# Altium schematic sheet Sheet2.SchDoc
size A1
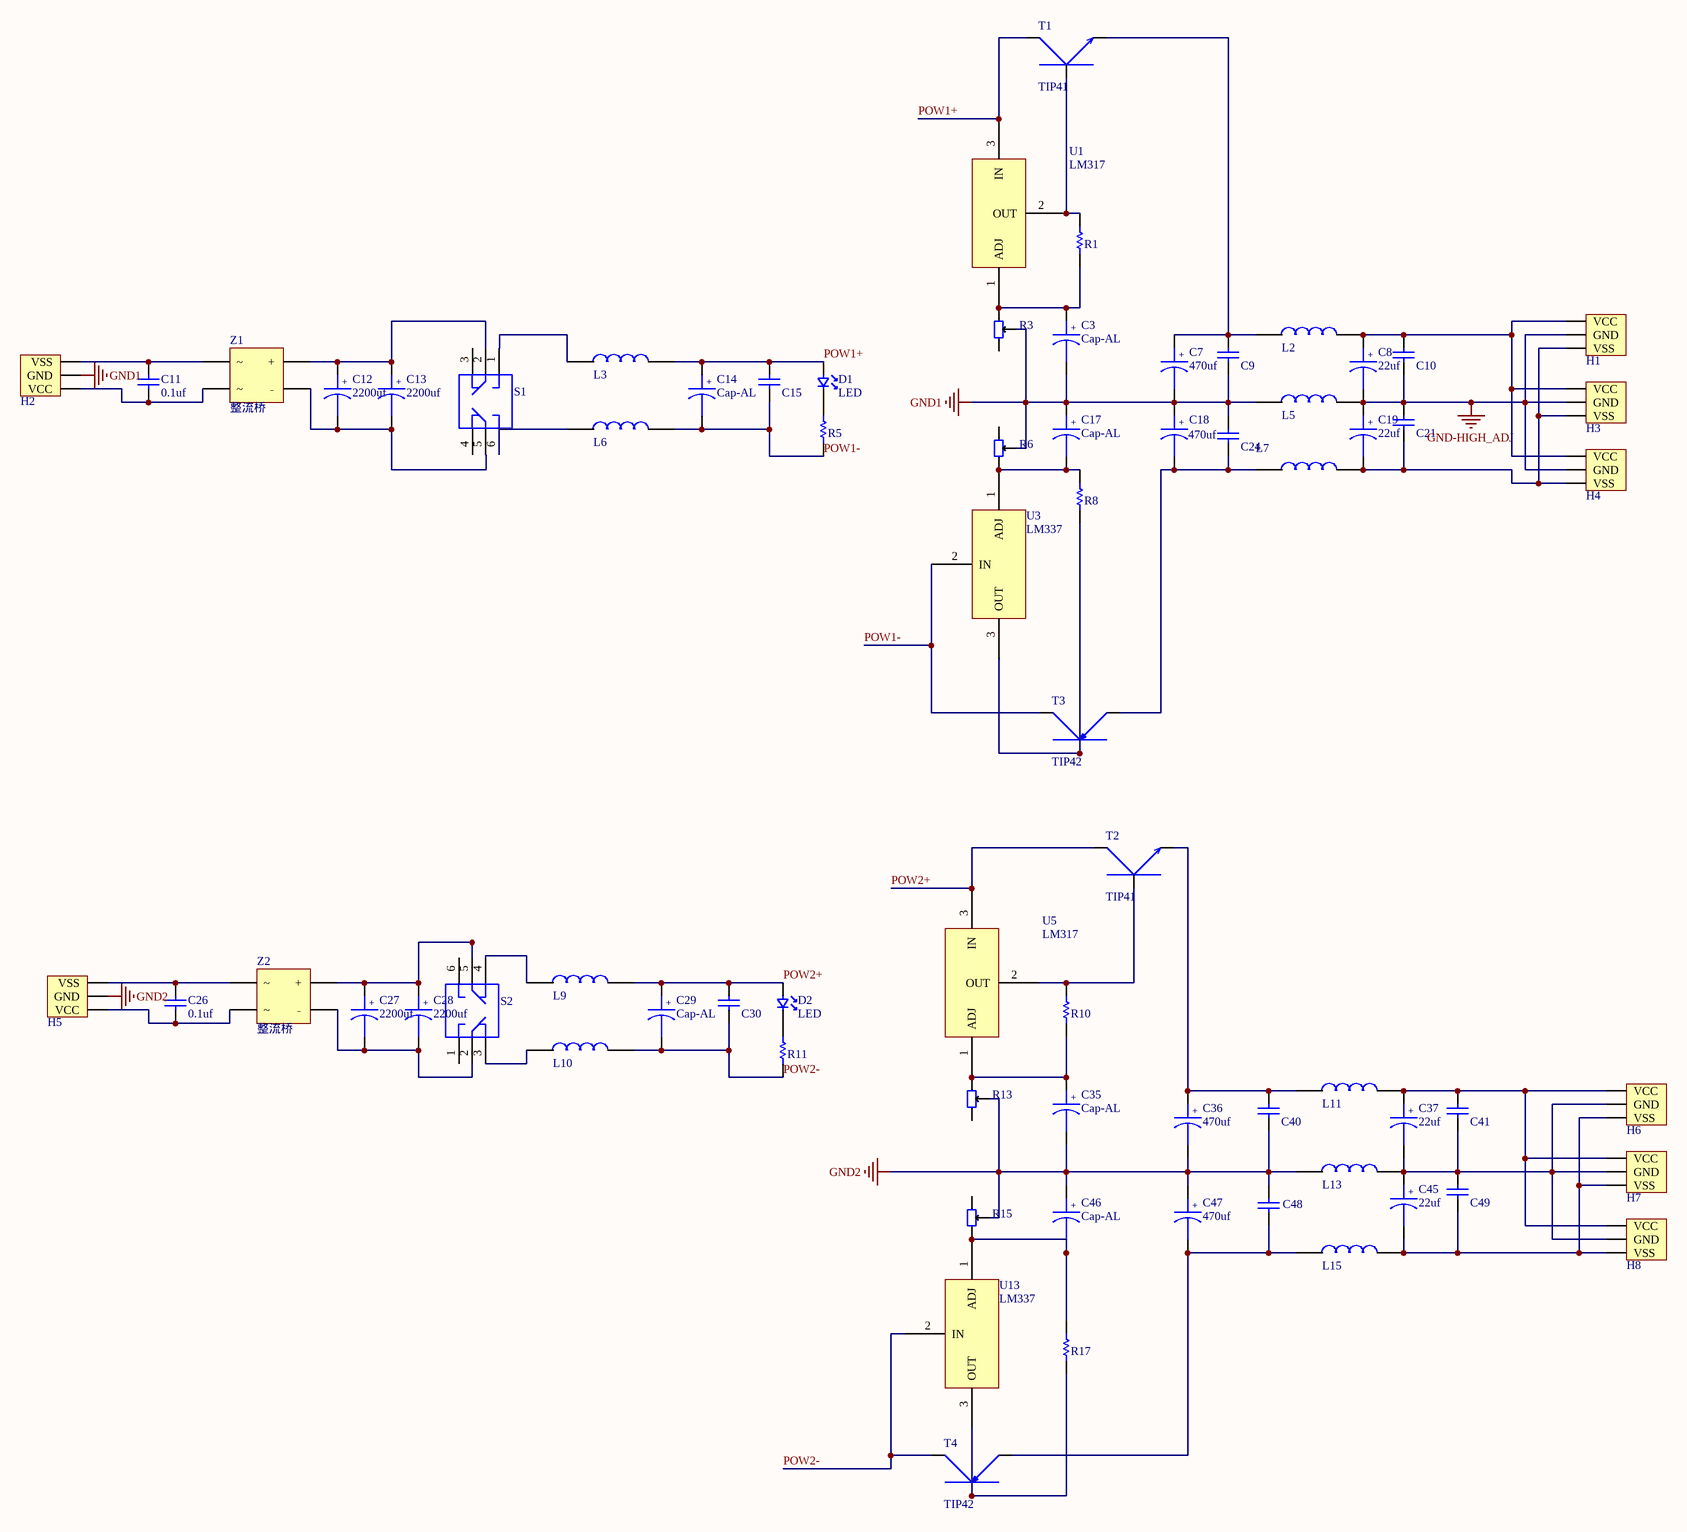
[diagram p0: Sheet2.SchDoc]

## Parts
C3  Cap-AL  [CD-2.2mm]
C7  470uf  [CD-5mm]
C8  22uf  [CD-3mm]
C9  Cap-SEMI  [独石电容]  (value not drawn)
C10  Cap-SEMI  [独石电容]  (value not drawn)
C11  值: 0.1uf  [安规电容]  (hidden comment: Cap1)
C12  2200uf  [CD-7.6mm]
C13  2200uf  [CD-7.6mm]
C14  Cap-AL  [CD-3mm]
C15  0.1uf  [独石电容]  (value not drawn)
C17  Cap-AL  [CD-2.2mm]
C18  470uf  [CD-5mm]
C19  22uf  [CD-3mm]
C21  Cap-SEMI  [独石电容]  (value not drawn)
C24  Cap-SEMI  [独石电容]  (value not drawn)
C26  值: 0.1uf  [安规电容]  (hidden comment: Cap1)
C27  2200uf  [CD-7.6mm]
C28  2200uf  [CD-7.6mm]
C29  Cap-AL  [CD-3mm]
C30  0.1uf  [独石电容]  (value not drawn)
C35  Cap-AL  [CD-2.2mm]
C36  470uf  [CD-5mm]
C37  22uf  [CD-3mm]
C40  Cap-SEMI  [独石电容]  (value not drawn)
C41  Cap-SEMI  [独石电容]  (value not drawn)
C45  22uf  [CD-3mm]
C46  Cap-AL  [CD-2.2mm]
C47  470uf  [CD-5mm]
C48  Cap-SEMI  [独石电容]  (value not drawn)
C49  Cap-SEMI  [独石电容]  (value not drawn)
D1  LED  [0805_s]
D2  LED  [0805_s]
H1  KF128-5.08-3P  [KF128-5.08-3P]  (value not drawn)
H2  KF128-5.08-3P  [KF128-5.08-3P]  (value not drawn)
H3  KF128-5.08-3P  [KF128-5.08-3P]  (value not drawn)
H4  KF128-5.08-3P  [KF128-5.08-3P]  (value not drawn)
H5  KF128-5.08-3P  [KF128-5.08-3P]  (value not drawn)
H6  KF128-5.08-3P  [KF128-5.08-3P]  (value not drawn)
H7  KF128-5.08-3P  [KF128-5.08-3P]  (value not drawn)
H8  KF128-5.08-3P  [KF128-5.08-3P]  (value not drawn)
L2  SMD  [功率电感-12x12 - duplicate]  (value not drawn)
L3  SMD  [功率电感-12x12 - duplicate]  (value not drawn)
L5  SMD  [功率电感-12x12 - duplicate]  (value not drawn)
L6  SMD  [功率电感-12x12 - duplicate]  (value not drawn)
L7  SMD  [功率电感-12x12 - duplicate]  (value not drawn)
L9  SMD  [功率电感-12x12 - duplicate]  (value not drawn)
L10  SMD  [功率电感-12x12 - duplicate]  (value not drawn)
L11  SMD  [功率电感-12x12 - duplicate]  (value not drawn)
L13  SMD  [功率电感-12x12 - duplicate]  (value not drawn)
L15  SMD  [功率电感-12x12 - duplicate]  (value not drawn)
R1  RES  [0805]  (value not drawn)
R3  可调电位器1  [电位器]  (value not drawn)
R5  RES  [0805]  (value not drawn)
R6  可调电位器1  [电位器]  (value not drawn)
R8  RES  [0805]  (value not drawn)
R10  RES  [0805]  (value not drawn)
R11  RES  [0805]  (value not drawn)
R13  可调电位器1  [电位器]  (value not drawn)
R15  可调电位器1  [电位器]  (value not drawn)
R17  RES  [0805]  (value not drawn)
S1  双掷开关  [SWITCH]  (value not drawn)
S2  双掷开关  [SWITCH]  (value not drawn)
T1  TIP41  [TO-220]
T2  TIP41  [TO-220]
T3  TIP42  [TO-220]
T4  TIP42  [TO-220]
U1  LM317  [TO-220]
U3  LM337  [TO-220]
U5  LM317  [TO-220]
U13  LM337  [TO-220]
Z1  整流桥  [整流桥]
Z2  整流桥  [整流桥]

## Nets
GND1: C3.2 C7.2 C9.1 C17.1 C18.1 C24.2 H2.2(GND) L5.1 R3.2 R6.2
GND2: C35.2 C36.2 C40.1 C46.1 C47.1 C48.2 H5.2(GND) L13.1 R13.2 R15.2
GND-HIGH_ADJ: C8.2 C10.1 C19.1 C21.2 H1.2(GND) H3.2(GND) H4.2(GND) L5.2
POW1+: C14.1 C15.2 D1.2 L3.2 T1.2 U1.3(IN)
POW1-: C14.2 C15.1 L6.2 R5.1 T3.2 U3.2(IN)
POW2+: C29.1 C30.2 D2.2 L9.2 T2.2 U5.3(IN)
POW2-: C29.2 C30.1 L10.2 R11.1 T4.2 U13.2(IN)
NetC3_1: C3.1 R1.1 R3.3 U1.1(ADJ)
NetC7_1: C7.1 C9.2 L2.1 T1.3
NetC8_1: C8.1 C10.2 H1.1(VCC) H3.1(VCC) H4.1(VCC) L2.2
NetC11_1: C11.1 H2.1(VCC) Z1.3
NetC11_2: C11.2 H2.3(VSS) Z1.2
NetC12_1: C12.1 C13.1 S1.2 Z1.1(+)
NetC12_2: C12.2 C13.2 S1.5 Z1.4(﹣)
NetC17_2: C17.2 R6.1 R8.2 U3.1(ADJ)
NetC18_2: C18.2 C24.1 L7.1 T3.3
NetC19_2: C19.2 C21.1 H1.3(VSS) H3.3(VSS) H4.3(VSS) L7.2
NetC26_1: C26.1 H5.1(VCC) Z2.3
NetC26_2: C26.2 H5.3(VSS) Z2.2
NetC27_1: C27.1 C28.1 S2.5 Z2.1(+)
NetC27_2: C27.2 C28.2 S2.2 Z2.4(﹣)
NetC35_1: C35.1 R10.1 R13.3 U5.1(ADJ)
NetC36_1: C36.1 C40.2 L11.1 T2.3
NetC37_1: C37.1 C41.2 H6.1(VCC) H7.1(VCC) H8.1(VCC) L11.2
NetC37_2: C37.2 C41.1 C45.1 C49.2 H6.2(GND) H7.2(GND) H8.2(GND) L13.2
NetC45_2: C45.2 C49.1 H6.3(VSS) H7.3(VSS) H8.3(VSS) L15.2
NetC46_2: C46.2 R15.1 R17.2 U13.1(ADJ)
NetC47_2: C47.2 C48.1 L15.1 T4.3
NetD1_1: D1.1 R5.2
NetD2_1: D2.1 R11.2
NetL3_1: L3.1 S1.1
NetL6_1: L6.1 S1.6
NetL9_1: L9.1 S2.4
NetL10_1: L10.1 S2.3
NetR1_2: R1.2 T1.1 U1.2(OUT)
NetR8_1: R8.1 T3.1 U3.3(OUT)
NetR10_2: R10.2 T2.1 U5.2(OUT)
NetR17_1: R17.1 T4.1 U13.3(OUT)

Not connected (* = marked no-connect by the designer): R3 1; R6 3; R13 1; R15 3; S1 3 4; S2 1 6

## Notes on the sheet
- (in symbol Cap) +
- (in symbol Cap-AL) +

## Library data of the parts
C7 C8 C18 C19 C36 C37 C45 C47 = Cap-AL
C12 C13 C27 C28 = Cap
C15 C30 = Cap-SEMI
L2 L3 L5-L7 L9-L11 L13 L15 = 功率电感
R1 R5 R8 R10 R11 R17 = RES: 值: 1k